# EAGLE schematic Servo8_BKP (EAGLE 7.6.0)
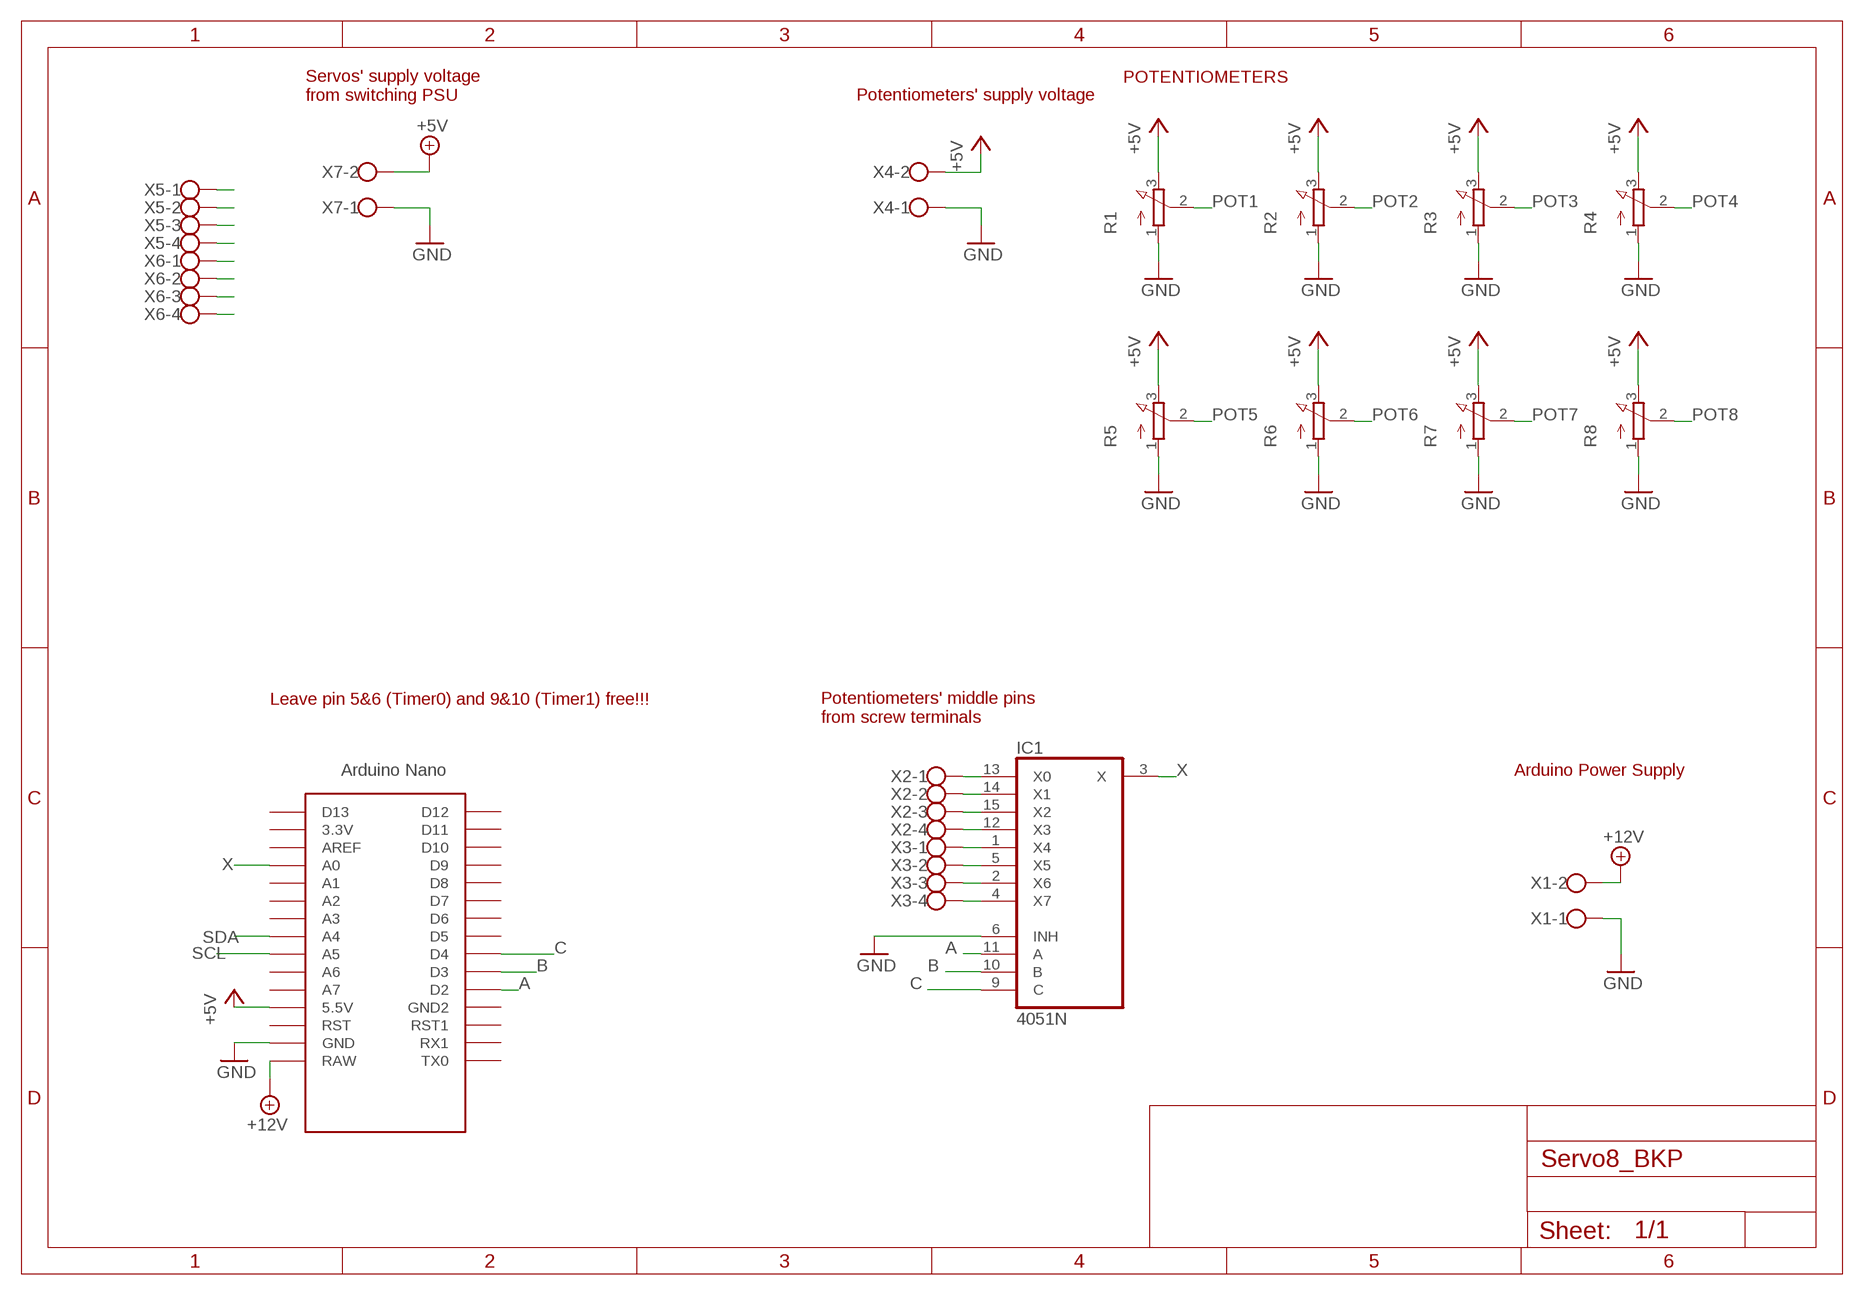
[diagram p0: schematic, sheet 1]

## Parts
IC1  4051N  [DIL16]
R1  3RP/1610N  [3RP/1610N]
R2  3RP/1610N  [3RP/1610N]
R3  3RP/1610N  [3RP/1610N]
R4  3RP/1610N  [3RP/1610N]
R5  3RP/1610N  [3RP/1610N]
R6  3RP/1610N  [3RP/1610N]
R7  3RP/1610N  [3RP/1610N]
R8  3RP/1610N  [3RP/1610N]
U$1  NANO  [NANO]
X1  W237-102  [W237-102]
X2  W237-4  [W237-4]
X3  W237-4  [W237-4]
X4  W237-102  [W237-102]
X5  W237-4  [W237-4]
X6  W237-4  [W237-4]
X7  W237-102  [W237-102]

## Nets
+5V: R1.3(E) R2.3(E) R3.3(E) R4.3(E) R5.3(E) R6.3(E) R7.3(E) R8.3(E) U$1.5V(5.5V) X4.2 X7.2
+12V: U$1.RAW X1.2
A: IC1.11(A) U$1.D2
B: IC1.10(B) U$1.D3
C: IC1.9(C) U$1.D4
GND: IC1.6(INH) R1.1(A) R2.1(A) R3.1(A) R4.1(A) R5.1(A) R6.1(A) R7.1(A) R8.1(A) U$1.GND X1.1 X4.1 X7.1
POT1: IC1.13(X0) R1.2(S) X2.1
POT2: IC1.14(X1) R2.2(S) X2.2
POT3: IC1.15(X2) R3.2(S) X2.3
POT4: IC1.12(X3) R4.2(S) X2.4
POT5: IC1.1(X4) R5.2(S) X3.1
POT6: IC1.5(X5) R6.2(S) X3.2
POT7: IC1.2(X6) R7.2(S) X3.3
POT8: IC1.4(X7) R8.2(S) X3.4
POT9: X5.1
POT10: X6.4
POT11: X6.3
POT12: X6.2
POT13: X6.1
POT14: X5.4
POT15: X5.3
POT16: X5.2
SCL: U$1.A5
SDA: U$1.A4
X: IC1.3(X) U$1.A0
Unconnected: U$1.3.3V U$1.A1 U$1.A2 U$1.A3 U$1.A6 U$1.A7 U$1.AREF U$1.D5 U$1.D6 U$1.D7 U$1.D8 U$1.D9 U$1.D10 U$1.D11 U$1.D12 U$1.D13 U$1.GND1(GND2) U$1.ICSP1 U$1.ICSP2 U$1.ICSP3 U$1.ICSP4 U$1.ICSP5 U$1.ICSP6 U$1.RST U$1.RST1 U$1.RX1 U$1.TX0

## Notes on the sheet
- POTENTIOMETERS
- Servos' supply voltage
  from switching PSU
- Potentiometers' supply voltage
- Leave pin 5&6 (Timer0) and 9&10 (Timer1) free!!!
- Potentiometers' middle pins 
  from screw terminals
- Arduino Power Supply

## Power pins joined to a net without a drawn wire
GND: IC1.8(GND)
VCC: IC1.16(VCC)
VEE: IC1.7(VEE)

## Library data of the parts
IC1 = 40xx:4051: 8-channel ANALOG MULTIPLEXER
R1-R8 = pot:3RP/1610N: 16mm Potentiometer one level Source: http://www.alphapotentiometers.net/html/16mm_pot_2.html
U$1 = Arduino-clone:NANO: Arduino Nano
X1 X4 X7 = con-wago-500:W237-102: WAGO SCREW CLAMP; MPN: 237-102; OC_FARNELL: unknown; OC_NEWARK: 70K9898
X2 X3 X5 X6 = con-wago-500:W237-4: WAGO SCREW CLAMP; OC_FARNELL: unknown; OC_NEWARK: unknown